# EAGLE design PGTNX03_vcf_bp_lp (EAGLE 9.6.0)
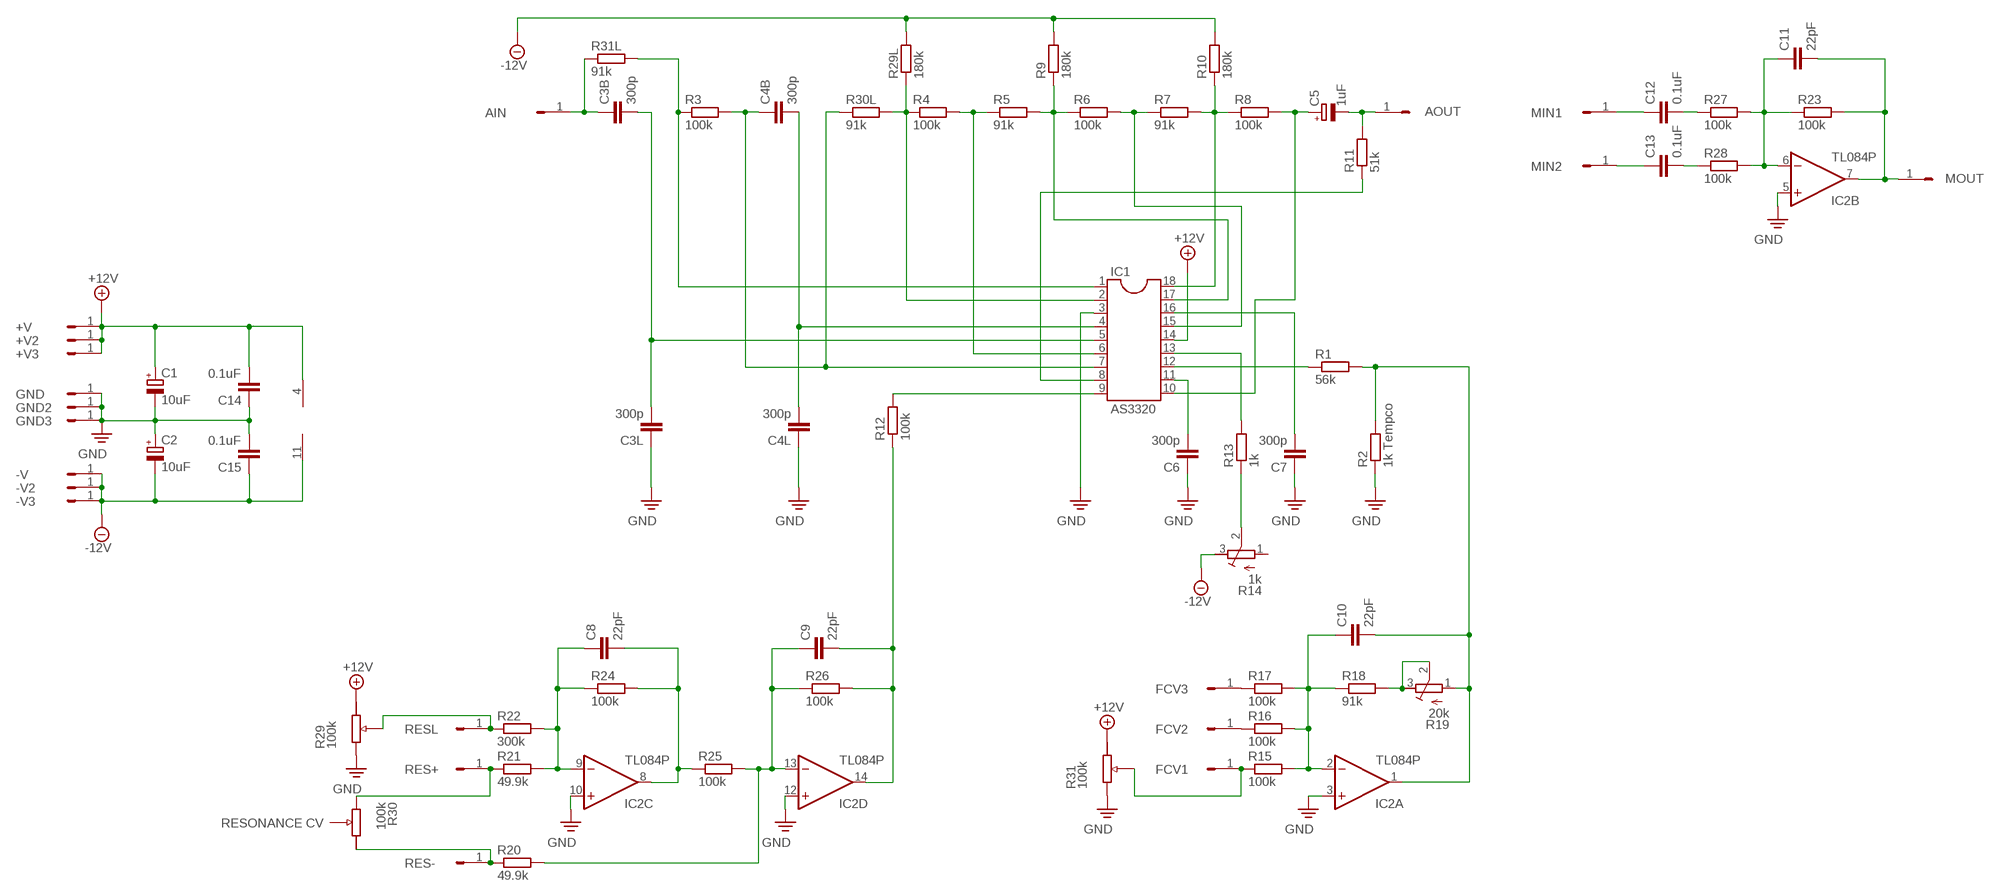
[diagram p0: schematic, sheet 1]

## Parts
+V  HEADER/MALE/01  [HEADER/MALE/01]
+V2  HEADER/MALE/01  [HEADER/MALE/01]
+V3  HEADER/MALE/01  [HEADER/MALE/01]
-V  HEADER/MALE/01  [HEADER/MALE/01]
-V2  HEADER/MALE/01  [HEADER/MALE/01]
-V3  HEADER/MALE/01  [HEADER/MALE/01]
AIN  HEADER/MALE/01  [HEADER/MALE/01]
AOUT  HEADER/MALE/01  [HEADER/MALE/01]
C1  10uF  CAPACITOR/POLARIZEDE2.5-6  [E2,5-6]
C2  10uF  CAPACITOR/POLARIZEDE2.5-6  [E2,5-6]
C3B  300p  CAPACITORCERAMICDISC/5  [CERAMICDISC/5]
C3L  300p  CAPACITORCERAMICDISC/5  [CERAMICDISC/5]
C4B  300p  CAPACITORCERAMICDISC/5  [CERAMICDISC/5]
C4L  300p  CAPACITORCERAMICDISC/5  [CERAMICDISC/5]
C5  1uF  CAPACITOR/POLARIZEDE2.5-6  [E2,5-6]
C6  300p  CAPACITORCERAMICDISC/5  [CERAMICDISC/5]
C7  300p  CAPACITORCERAMICDISC/5  [CERAMICDISC/5]
C8  22pF  CAPACITORCERAMICDISC/5  [CERAMICDISC/5]
C9  22pF  CAPACITORCERAMICDISC/5  [CERAMICDISC/5]
C10  22pF  CAPACITORCERAMICDISC/5  [CERAMICDISC/5]
C11  22pF  CAPACITORCERAMICDISC/5  [CERAMICDISC/5]
C12  0.1uF  CAPACITORCERAMICDISC/5  [CERAMICDISC/5]
C13  0.1uF  CAPACITORCERAMICDISC/5  [CERAMICDISC/5]
C14  0.1uF  CAPACITORCERAMICDISC/5  [CERAMICDISC/5]
C15  0.1uF  CAPACITORCERAMICDISC/5  [CERAMICDISC/5]
FCV1  HEADER/MALE/01  [HEADER/MALE/01]
FCV2  HEADER/MALE/01  [HEADER/MALE/01]
FCV3  HEADER/MALE/01  [HEADER/MALE/01]
GND  HEADER/MALE/01  [HEADER/MALE/01]
GND2  HEADER/MALE/01  [HEADER/MALE/01]
GND3  HEADER/MALE/01  [HEADER/MALE/01]
IC1  AS3320  DIL18  [DIL18]
IC2  TL084P  [DIL14]
MIN1  HEADER/MALE/01  [HEADER/MALE/01]
MIN2  HEADER/MALE/01  [HEADER/MALE/01]
MOUT  HEADER/MALE/01  [HEADER/MALE/01]
R1  56k  RESISTORRESISTOR/UPRIGHT/7.5  [RESISTOR/7.5]
R2  1k Tempco  RESISTORRESISTOR/UPRIGHT/7.5  [RESISTOR/7.5]
R3  100k  RESISTORRESISTOR/UPRIGHT/7.5  [RESISTOR/7.5]
R4  100k  RESISTORRESISTOR/UPRIGHT/7.5  [RESISTOR/7.5]
R5  91k  RESISTORRESISTOR/UPRIGHT/7.5  [RESISTOR/7.5]
R6  100k  RESISTORRESISTOR/UPRIGHT/7.5  [RESISTOR/7.5]
R7  91k  RESISTORRESISTOR/UPRIGHT/7.5  [RESISTOR/7.5]
R8  100k  RESISTORRESISTOR/UPRIGHT/7.5  [RESISTOR/7.5]
R9  180k  RESISTORRESISTOR/UPRIGHT/7.5  [RESISTOR/7.5]
R10  180k  RESISTORRESISTOR/UPRIGHT/7.5  [RESISTOR/7.5]
R11  51k  RESISTORRESISTOR/UPRIGHT/7.5  [RESISTOR/7.5]
R12  100k  RESISTORRESISTOR/UPRIGHT/7.5  [RESISTOR/7.5]
R13  1k  RESISTORRESISTOR/UPRIGHT/7.5  [RESISTOR/7.5]
R14  1k  TRIMMER64X  [TRIMMER/64B]
R15  100k  RESISTORRESISTOR/UPRIGHT/7.5  [RESISTOR/7.5]
R16  100k  RESISTORRESISTOR/UPRIGHT/7.5  [RESISTOR/7.5]
R17  100k  RESISTORRESISTOR/UPRIGHT/7.5  [RESISTOR/7.5]
R18  91k  RESISTORRESISTOR/UPRIGHT/7.5  [RESISTOR/7.5]
R19  20k  TRIMMER64X  [TRIMMER/64B]
R20  49.9k  RESISTORRESISTOR/UPRIGHT/7.5  [RESISTOR/7.5]
R21  49.9k  RESISTORRESISTOR/UPRIGHT/7.5  [RESISTOR/7.5]
R22  300k  RESISTORRESISTOR/UPRIGHT/7.5  [RESISTOR/7.5]
R23  100k  RESISTORRESISTOR/UPRIGHT/7.5  [RESISTOR/7.5]
R24  100k  RESISTORRESISTOR/UPRIGHT/7.5  [RESISTOR/7.5]
R25  100k  RESISTORRESISTOR/UPRIGHT/7.5  [RESISTOR/7.5]
R26  100k  RESISTORRESISTOR/UPRIGHT/7.5  [RESISTOR/7.5]
R27  100k  RESISTORRESISTOR/UPRIGHT/7.5  [RESISTOR/7.5]
R28  100k  RESISTORRESISTOR/UPRIGHT/7.5  [RESISTOR/7.5]
R29  100k  POTENTIOMETER  (no package)
R29L  180k  RESISTORRESISTOR/UPRIGHT/7.5  [RESISTOR/7.5]
R30  100k  POTENTIOMETER  (no package)
R30L  91k  RESISTORRESISTOR/UPRIGHT/7.5  [RESISTOR/7.5]
R31  100k  POTENTIOMETER  (no package)
R31L  91k  RESISTORRESISTOR/UPRIGHT/7.5  [RESISTOR/7.5]
RES+  HEADER/MALE/01  [HEADER/MALE/01]
RES-  HEADER/MALE/01  [HEADER/MALE/01]
RESL  HEADER/MALE/01  [HEADER/MALE/01]

## Nets
+12V: +V2.1 +V3.1 +V.1 C1.+ C14.2 IC1.14 IC2.4(P:V+) R29.A R31.A
-12V: -V2.1 -V3.1 -V.1 C2.- C15.1 IC2.11(P:V-) R9.2 R10.2 R14.3(A) R29L.2
GND: C1.- C2.+ C3L.1 C4L.1 C6.1 C7.1 C14.1 C15.2 GND2.1 GND3.1 GND.1 IC1.3 IC2.3(A:+IN) IC2.5(B:+IN) IC2.10(C:+IN) IC2.12(D:+IN) R2.1
MOUT: C11.2 IC2.7(B:OUT) MOUT.1 R23.2
N$1: C3B.2 C3L.2 IC1.5
N$2: AIN.1 C3B.1 R31L.1
N$3: IC1.12 R1.1
N$4: R20.1 R30.A RES-.1
N$5: C4B.1 IC1.7 R3.2 R30L.1
N$6: IC1.6 R4.2 R5.1
N$7: IC1.17 R5.2 R6.1 R9.1
N$8: IC1.15 R6.2 R7.1
N$9: IC1.18 R7.2 R8.1 R10.1
N$10: IC1.9 R12.2
N$11: C5.+ IC1.10 R8.2
N$12: AOUT.1 C5.- R11.2
N$13: R18.2 R19.2(S) R19.3(A)
N$14: C6.2 IC1.11
N$15: C7.2 IC1.16
N$16: FCV2.1 R16.1
N$17: FCV3.1 R17.1
N$18: IC1.13 R13.2
N$19: R13.1 R14.2(S)
N$20: IC1.1 R3.1 R31L.2
N$21: C4B.2 C4L.2 IC1.4
N$22: IC1.2 R4.1 R29L.1 R30L.2
N$23: IC1.8 R11.1
N$24: C10.2 IC2.1(A:OUT) R1.2 R2.2 R19.1(E)
N$25: C10.1 IC2.2(A:-IN) R15.2 R16.2 R17.2 R18.1
N$26: C12.2 R27.1
N$27: FCV1.1 R15.1 R31.S
N$28: C11.1 IC2.6(B:-IN) R23.1 R27.2 R28.2
N$29: C8.1 IC2.9(C:-IN) R21.2 R22.2 R24.1
N$30: R21.1 R30.E RES+.1
N$31: R22.1 R29.S RESL.1
N$32: C13.2 R28.1
N$33: C8.2 IC2.8(C:OUT) R24.2 R25.1
N$34: C9.1 IC2.13(D:-IN) R20.2 R25.2 R26.1
N$35: C9.2 IC2.14(D:OUT) R12.1 R26.2
N$36: C12.1 MIN1.1
N$37: C13.1 MIN2.1
PE: R29.E R31.E ; supply symbol labelled GND
Unconnected: R14.1(E) R30.S

## Notes on the sheet
- RESONANCE CV

## Library data of the parts
+V +V2 +V3 -V -V2 -V3 GND GND2 GND3 = connectors:HEADER/MALE/01; SPICEPREFIX: X
AIN AOUT FCV1-FCV3 MIN1 MIN2 MOUT RES+ RES- RESL = connectors:HEADER/MALE/01
C1 C2 = capacitors:CAPACITOR/POLARIZED: POLARIZED CAPACITOR, European symbol; SPICEPREFIX: C
C3B C3L C4B C4L C6-C15 = capacitors:CAPACITOR: CAPACITOR, European symbol
C5 = capacitors:CAPACITOR/POLARIZED: POLARIZED CAPACITOR, European symbol
IC1 = ic_package:DIL18: Dual In Line / Socket
IC2 = ic_analogue:TL084: OP AMP
R1-R13 R15-R18 R20-R28 R29L R30L R31L = resistors:RESISTOR: RESISTOR, European symbol
R14 R19 = resistors:TRIMMER: Trimm resistor
R29-R31 = controls_off_brd:POTENTIOMETER: Trimm resistor; _EXTERNAL_: 1

## Board
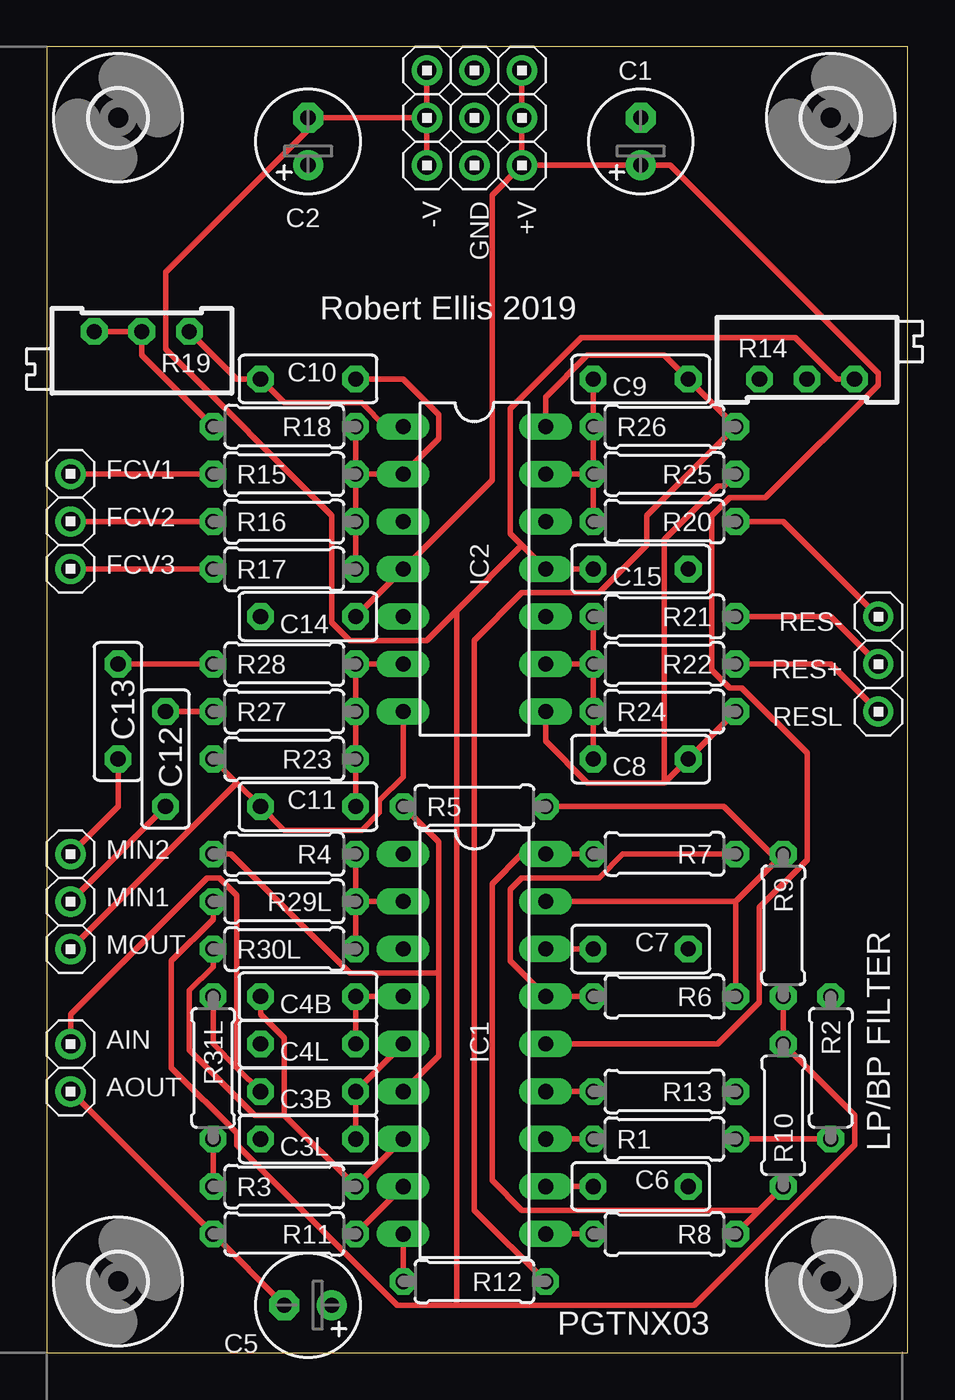
[diagram p1: board, top side]
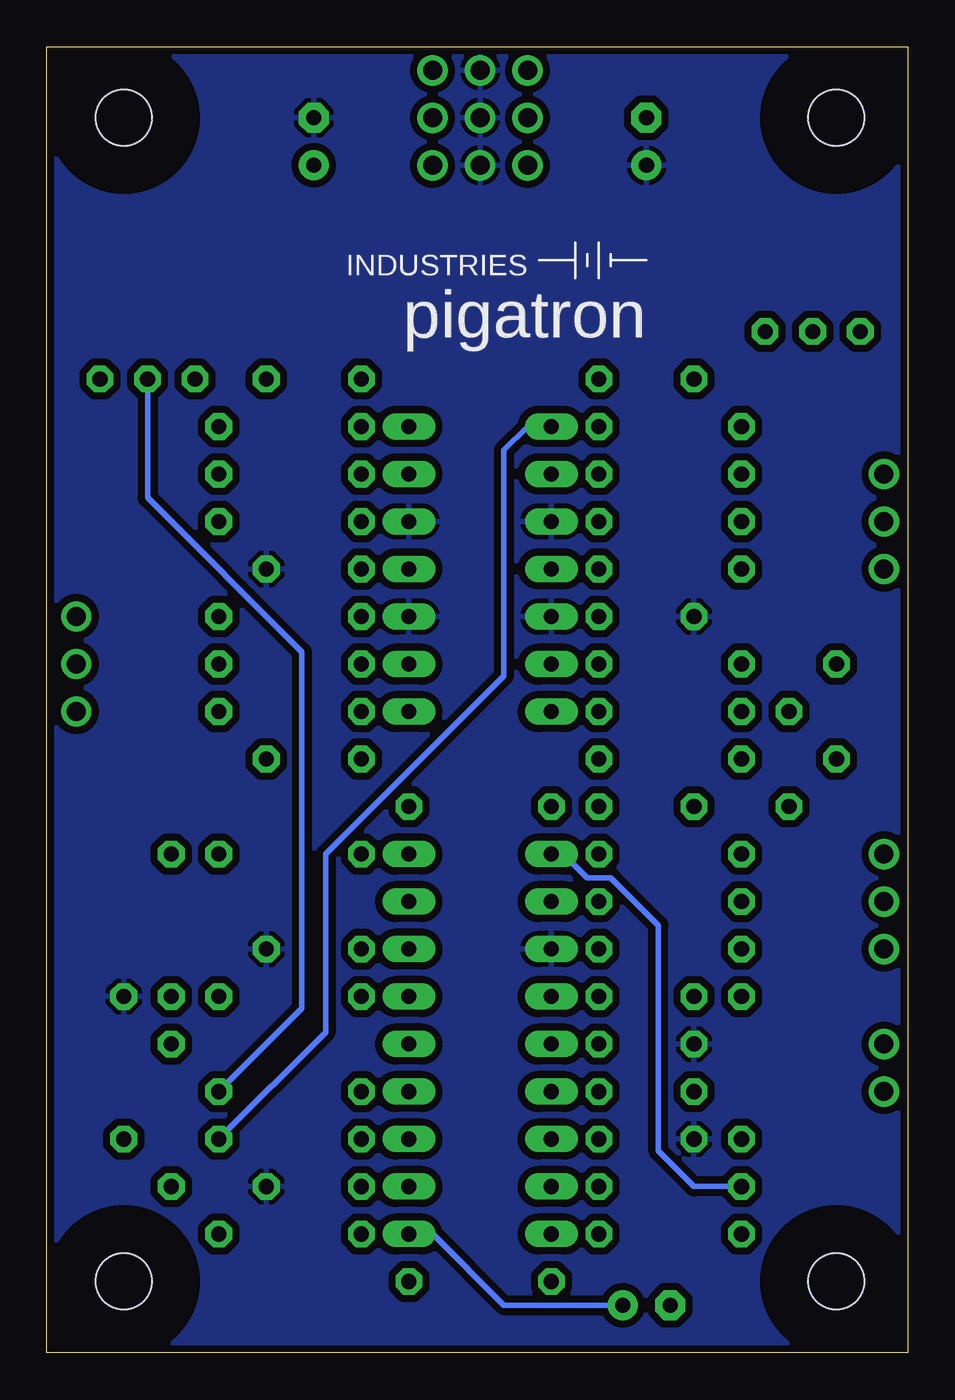
[diagram p2: board, bottom side, seen from below]

Size 46.02 x 69.84 mm. Coordinates in mm from the lower left corner, seen from the top.
Outline: 0,0 46.02,0 46.02,69.84 0,69.84 0,0
Copper layers (1*16): Top 0.0356mm / dielectric 1.5011mm / Bottom 0.0356mm
Design rules "pigatron": minimum track width 12mil, minimum drill 13mil, track to track 15mil, track to pad 10mil, pad to pad 10mil, via to via 10mil, smd to smd 6mil, copper to edge 15mil, drill to drill 10mil, minimum pad ring 12mil, minimum via ring 10mil, stop-mask expansion 4mil, vias tented up to drill 0mil, thermal gap 10mil

### Footprints (pad centres in the part's own frame; a part is rotated, then mirrored left to right if it is on the bottom)
HEADER/MALE/01 = drill 1.016: 1 0,0
E2,5-6 = drill 0.813 pad 1.6: + -1.27,0 | drill 0.813 pad 1.6 octagon: - 1.27,0
CERAMICDISC/5 = drill 0.813 octagon: 1 -2.54,0; 2 2.54,0
DIL18 = drill 0.813 long: 1 -10.16,-3.81; 2 -7.62,-3.81; 3 -5.08,-3.81; 4 -2.54,-3.81; 5 0,-3.81; 6 2.54,-3.81; 7 5.08,-3.81; 8 7.62,-3.81; 9 10.16,-3.81; 10 10.16,3.81; 11 7.62,3.81; 12 5.08,3.81; 13 2.54,3.81; 14 0,3.81; 15 -2.54,3.81; 16 -5.08,3.81; 17 -7.62,3.81; 18 -10.16,3.81
DIL14 = drill 0.813 long: 1 -7.62,-3.81; 2 -5.08,-3.81; 3 -2.54,-3.81; 4 0,-3.81; 5 2.54,-3.81; 6 5.08,-3.81; 7 7.62,-3.81; 8 7.62,3.81; 9 5.08,3.81; 10 2.54,3.81; 11 0,3.81; 12 -2.54,3.81; 13 -5.08,3.81; 14 -7.62,3.81
RESISTOR/7.5 = drill 0.813 octagon: 1 -3.81,0; 2 3.81,0
TRIMMER/64B = drill 0.813 octagon: 1 1.27,-2.54; 2 1.27,0; 3 1.27,2.54
STANDOFF/3.0 = hole 3: 0,0

### Placement (x,y rotation side)
+V  25.4,63.5 270 top
+V2  25.4,66.04 270 top
+V3  25.4,68.58 270 top
-V  20.32,63.5 270 top
-V2  20.32,66.04 270 top
-V3  20.32,68.58 270 top
AIN  1.27,16.51 0 top
AOUT  1.27,13.97 0 top
C1  31.75,64.77 90 top
C2  13.97,64.77 90 top
C3B  13.97,13.97 0 top
C3L  13.97,11.43 0 top
C4B  13.97,19.05 0 top
C4L  13.97,16.51 0 top
C5  13.97,2.54 180 top
C6  31.75,8.89 180 top
C7  31.75,21.59 180 top
C8  31.75,31.75 0 top
C9  31.75,52.07 0 top
C10  13.97,52.07 180 top
C11  13.97,29.21 180 top
C12  6.35,31.75 90 top
C13  3.81,34.29 90 top
C14  13.97,39.37 0 top
C15  31.75,41.91 0 top
FCV1  1.27,46.99 0 top
FCV2  1.27,44.45 0 top
FCV3  1.27,41.91 0 top
GND  22.86,63.5 270 top
GND2  22.86,68.58 270 top
GND3  22.86,66.04 270 top
IC1  22.86,16.51 270 top
IC2  22.86,41.91 270 top
MIN1  1.27,24.13 0 top
MIN2  1.27,26.67 0 top
MOUT  1.27,21.59 0 top
R1  33.02,11.43 0 top
R2  41.91,15.24 270 top
R3  12.7,8.89 0 top
R4  12.7,26.67 180 top
R5  22.86,29.21 0 top
R6  33.02,19.05 180 top
R7  33.02,26.67 180 top
R8  33.02,6.35 180 top
R9  39.37,22.86 270 top
R10  39.37,12.7 90 top
R11  12.7,6.35 180 top
R12  22.86,3.81 180 top
R13  33.02,13.97 180 top
R14  40.64,53.34 270 top
R15  12.7,46.99 0 top
R16  12.7,44.45 0 top
R17  12.7,41.91 0 top
R18  12.7,49.53 180 top
R19  5.08,53.34 90 top
R20  33.02,44.45 180 top
R21  33.02,39.37 180 top
R22  33.02,36.83 180 top
R23  12.7,31.75 180 top
R24  33.02,34.29 0 top
R25  33.02,46.99 180 top
R26  33.02,49.53 0 top
R27  12.7,34.29 0 top
R28  12.7,36.83 0 top
R29L  12.7,24.13 180 top
R30L  12.7,21.59 0 top
R31L  8.89,15.24 270 top
RES+  44.45,36.83 180 top
RES-  44.45,39.37 180 top
RESL  44.45,34.29 180 top
U$1  [STANDOFF/3.0]  3.81,66.04 0 top
U$2  [STANDOFF/3.0]  3.81,3.81 0 top
U$3  [STANDOFF/3.0]  41.91,3.81 0 top
U$4  [STANDOFF/3.0]  41.91,66.04 0 top
U$6  [PIGATRON-LOGO]  22.86,56.83 180 bottom

### Tracks (layer width: path | path; a pad name or v marks a point on that pad's centre or on a via)
+12V
  Top 0.305: C14.2 IC2.4 23.81,46.67 23.81,61.91 +V.1 | +V.1 +V2.1 +V3.1 | IC1.14 35.88,16.51 38.1,18.73 38.1,23.81 40.64,26.35 40.64,32.07 37.15,35.56 36.51,35.56 35.56,36.51 35.56,44.77 36.51,45.72 38.42,45.72 44.45,51.75 44.45,52.39 33.34,63.5 C1.+ +V.1
-12V
  Top 0.305: R29L.2 8.89,23.18 6.67,20.95 6.67,15.24 10.16,11.75 10.16,11.11 18.73,2.54 21.91,2.54 | 21.91,2.54 34.61,2.54 43.18,11.11 43.18,12.7 R10.2 R9.2 | -V2.1 C2.- 13.97,65.41 6.35,57.78 6.35,53.66 15.24,44.77 15.24,39.05 16.19,38.1 20.32,38.1 21.91,39.69 | -V2.1 -V.1 | -V2.1 -V3.1 | C15.1 IC2.11 25.4,43.18 | R14.3 42.23,52.07 40.01,54.29 28.57,54.29 24.77,50.48 24.77,43.81 25.4,43.18 | 25.4,43.18 21.91,39.69 | 21.91,39.69 21.91,2.54
GND
  pour Bottom: 0,69.85 0,0 45.72,0 45.72,69.85
MOUT
  Top 0.305: R23.2 10.16,30.48 | 10.16,30.48 C11.2 12.7,27.94 16.83,27.94 17.78,28.89 17.78,29.53 19.05,30.8 IC2.7 | 10.16,30.48 MOUT.1
N$1
  Top 0.305: C3L.2 C3B.2 IC1.5
N$2
  Top 0.305: R31L.1 8.89,16.51 10.16,15.24 | C3B.1 10.16,15.24 | AIN.1 1.27,18.1 8.57,25.4 9.21,25.4 10.16,24.45 10.16,15.24
N$3
  Top 0.305: R1.1 IC1.12
N$4
  Top 0.305: R20.1 39.37,44.45 RES-.1
N$5
  Top 0.305: R30L.1 8.89,20.64 7.62,19.37 7.62,16.19 11.11,12.7 12.7,12.7 | 12.7,12.7 R3.2 IC1.7 | C4B.1 11.43,18.1 12.7,16.83 12.7,12.7
N$6
  Top 0.305: IC1.6 20.95,15.88 20.95,20.32 | 20.95,20.32 20.95,27.3 R5.1 | R4.2 9.84,26.67 16.19,20.32 20.95,20.32
N$7
  Top 0.305: 36.83,24.13 IC1.17 | 39.05,26.35 36.83,24.13 | R5.2 36.2,29.21 39.05,26.35 | 39.05,26.35 R9.1 | 36.83,24.13 R6.1
N$8
  Top 0.305: R6.2 IC1.15 24.77,20.95 24.77,24.77 25.4,25.4 29.53,25.4 30.8,26.67 R7.1
N$9
  Top 0.305: R7.2 IC1.18 25.4,26.67 23.81,25.08 23.81,9.21 25.4,7.62 38.1,7.62 | R10.1 38.1,7.62 | 38.1,7.62 R8.1
N$10
  Top 0.305: IC1.9 R12.2
N$11
  Top 0.305: R8.2 IC1.10
  Bottom 0.305: C5.+ 21.59,2.54 25.4,6.35 IC1.10
N$12
  Top 0.305: C5.- R11.2 AOUT.1
N$13
  Top 0.305: R18.2 5.08,53.34 R19.2 R19.3
N$14
  Top 0.305: C6.2 IC1.11
N$15
  Top 0.305: C7.2 IC1.16
N$16
  Top 0.305: FCV2.1 R16.1
N$17
  Top 0.305: FCV3.1 R17.1
N$18
  Top 0.305: R13.2 IC1.13
N$19
  Bottom 0.305: R13.1 32.38,18.41 32.38,37.47 40.64,45.72 R14.2
N$20
  Top 0.305: R31L.2 R3.1
  Bottom 0.305: IC1.1 18.41,26.67 17.14,25.4 15.88,25.4 13.34,22.86 13.34,10.79 11.43,8.89 R3.1
N$21
  Top 0.305: C4L.2 C4B.2 IC1.4
N$22
  Top 0.305: R29L.1 R30L.2 | R29L.1 R4.1 | R29L.1 IC1.2
N$23
  Top 0.305: IC1.8 R11.1
N$24
  Top 0.305: R2.2 R1.2 | R19.1 10.16,52.07 C10.2 12.7,50.8 16.83,50.8 18.1,49.53 IC2.1
  Bottom 0.305: R1.2 31.11,17.14 31.11,26.67 21.59,36.2 21.59,48.26 20.32,49.53 IC2.1
N$25
  Top 0.305: R17.2 R16.2 R15.2 | R18.1 R15.2 | C10.1 19.05,52.07 20.95,50.16 20.95,48.9 IC2.2 R15.2
N$26
  Top 0.305: R27.1 C12.2
N$27
  Top 0.305: FCV1.1 R15.1
N$28
  Top 0.305: C11.1 R23.1 R27.2 R28.2 IC2.6
N$29
  Top 0.305: C8.1 R24.1 R22.2 | R22.2 IC2.9 | R22.2 R21.2
N$30
  Top 0.305: R21.1 41.91,39.37 RES+.1
N$31
  Top 0.305: R22.1 41.91,36.83 RESL.1
N$32
  Top 0.305: R28.1 C13.2
N$33
  Top 0.305: R24.2 C8.2 33.02,30.48 | IC2.8 26.67,32.7 28.89,30.48 33.02,30.48 | R25.1 36.2,46.35 35.88,46.35 33.02,43.5 33.02,30.48
N$34
  Top 0.305: C9.1 R26.1 R25.2 | R25.2 IC2.13 | R25.2 R20.2
N$35
  Top 0.305: IC2.14 26.67,51.12 28.89,53.34 33.02,53.34 C9.2 R26.2 32.07,44.77 32.07,43.18 29.53,40.64 25.4,40.64 22.86,38.1 22.86,7.62 R12.1
N$36
  Top 0.305: MIN1.1 C12.1
N$37
  Top 0.305: C13.1 3.81,29.21 MIN2.1

### Text on the board
tNames: Robert Ellis 2019 | LP/BP FILTER | PGTNX03